# Altium schematic sheet [03] - 28PINS SCHEMATIC.SchDoc (part 1 of 3)
size 558 x 419 mm; DocumentNumber: 3; SheetNumber: 4; SheetTotal: 5
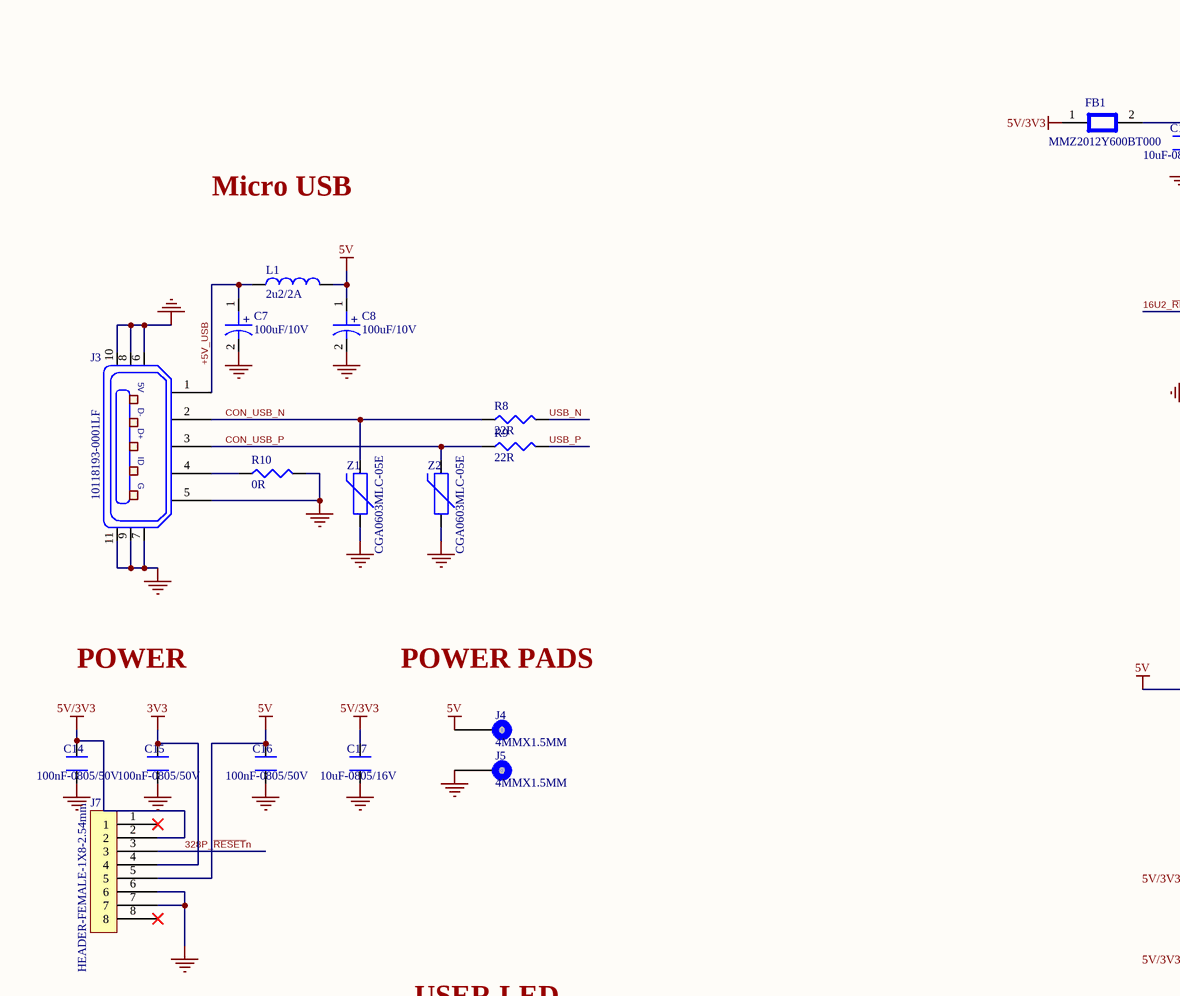
[diagram p0: [03] - 28PINS SCHEMATIC.SchDoc, top left]
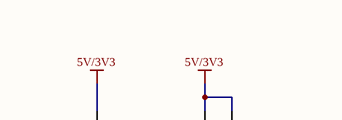
[diagram p1: [03] - 28PINS SCHEMATIC.SchDoc, top right]
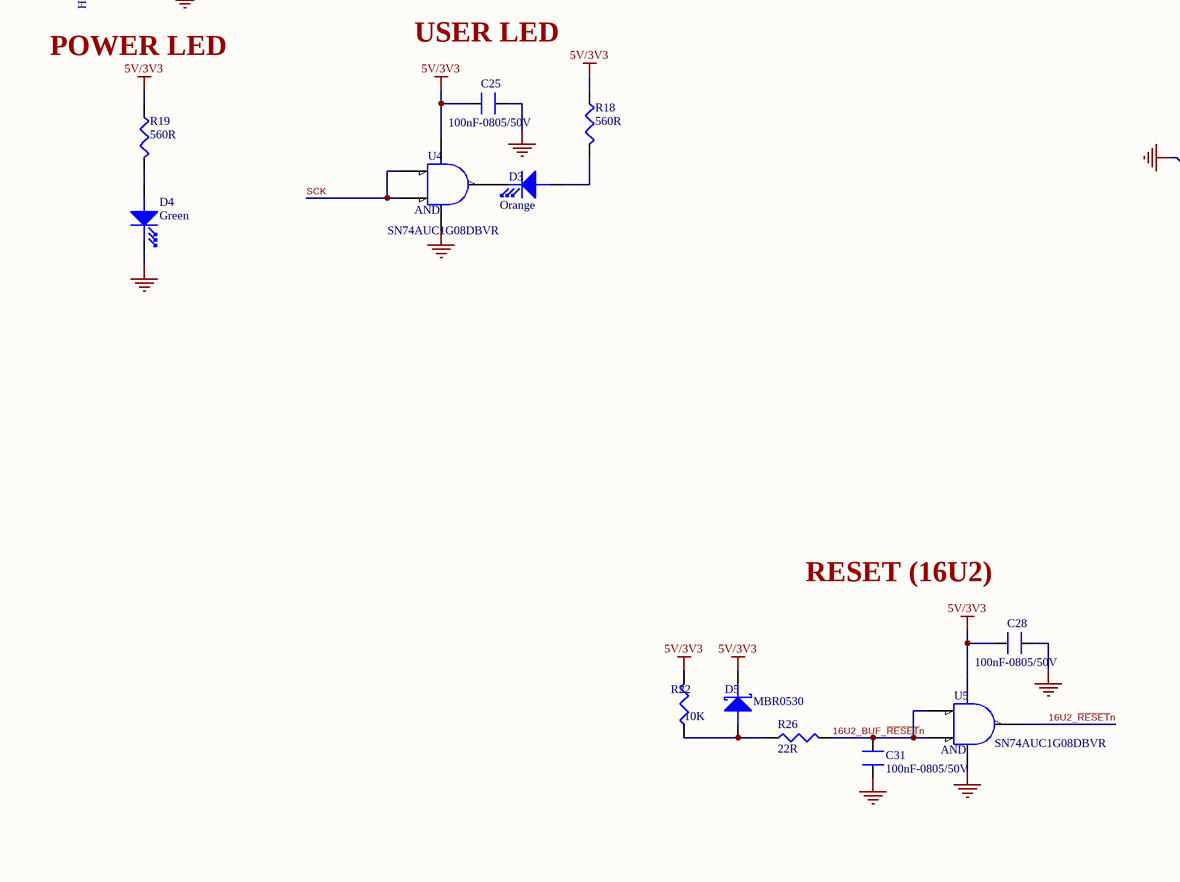
[diagram p2: [03] - 28PINS SCHEMATIC.SchDoc, bottom left]
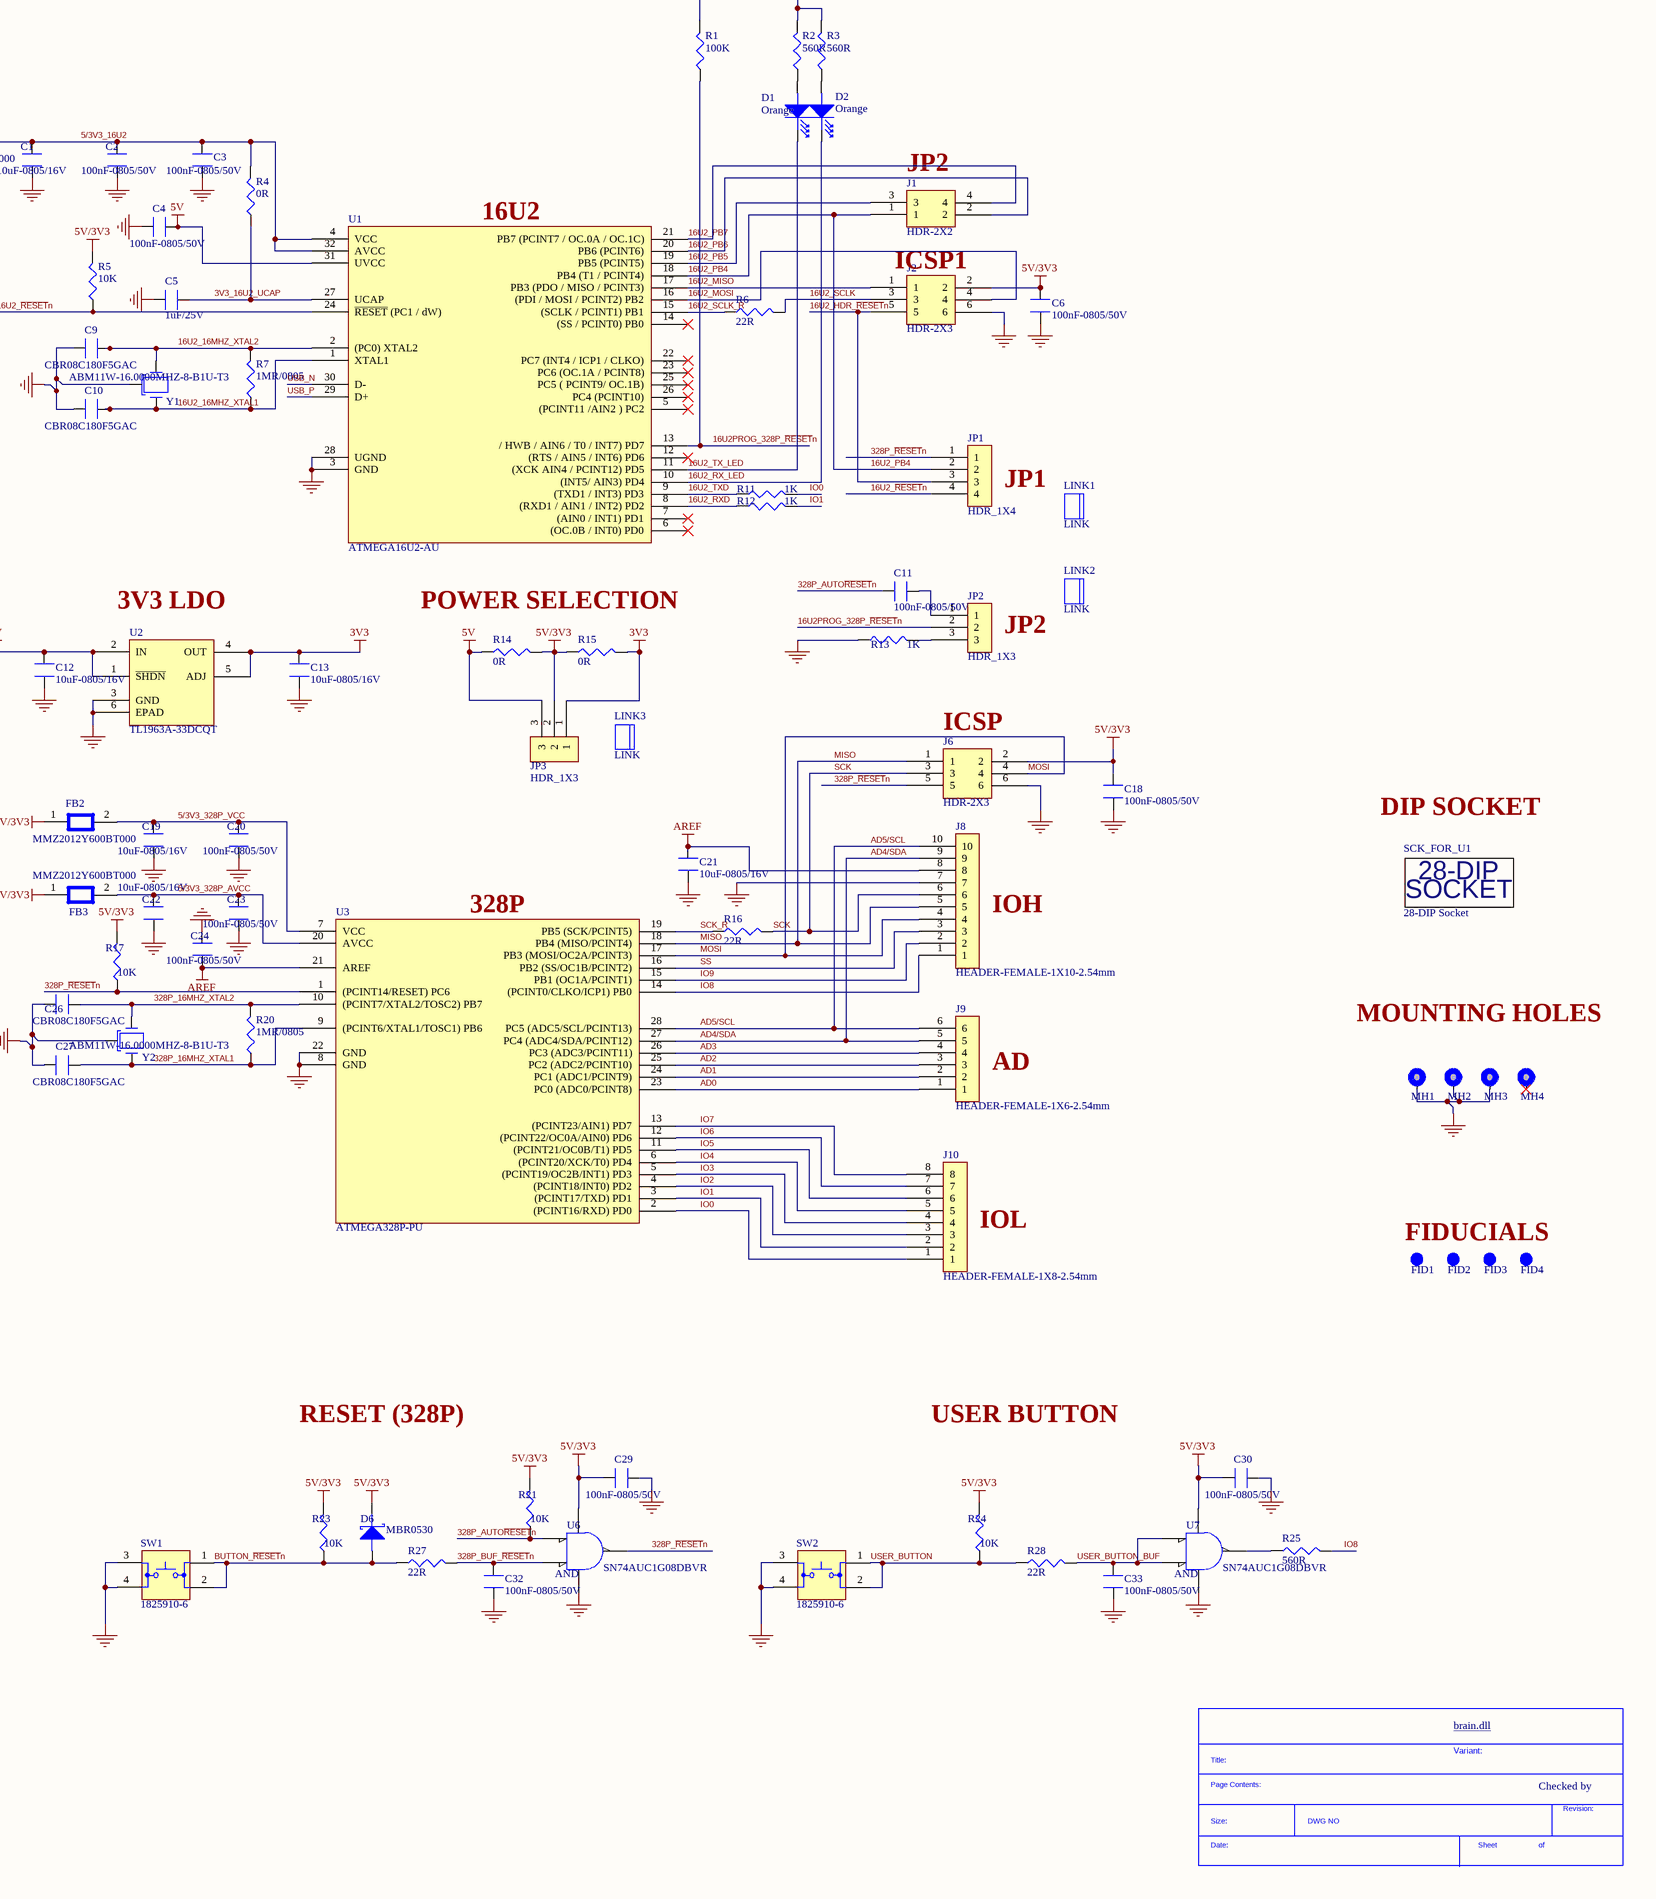
[diagram p3: [03] - 28PINS SCHEMATIC.SchDoc, bottom right]

## Parts
*?  SDTitleBlock  (value not drawn)  (graphical)
C1  10uF-0805/16V  [C0805]
C2  100nF-0805/50V  [C0805]
C3  100nF-0805/50V  [C0805]
C4  100nF-0805/50V  [C0805]
C5  1uF/25V  [C0805]
C6  100nF-0805/50V  [C0805]
C7  100uF/10V  [C_ALU_E_SIZE]
C8  100uF/10V  [C_ALU_E_SIZE]
C9  CBR08C180F5GAC  [C0805]
C10  CBR08C180F5GAC  [C0805]
C11  100nF-0805/50V  [C0805]
C12  10uF-0805/16V  [C0805]
C13  10uF-0805/16V  [C0805]
C14  100nF-0805/50V  [C0805]
C15  100nF-0805/50V  [C0805]
C16  100nF-0805/50V  [C0805]
C17  10uF-0805/16V  [C0805]
C18  100nF-0805/50V  [C0805]
C19  10uF-0805/16V  [C0805]
C20  100nF-0805/50V  [C0805]
C21  10uF-0805/16V  [C0805]
C22  10uF-0805/16V  [C0805]
C23  100nF-0805/50V  [C0805]
C24  100nF-0805/50V  [C0805]
C25  100nF-0805/50V  [C0805]
C26  CBR08C180F5GAC  [C0805]
C27  CBR08C180F5GAC  [C0805]
C28  100nF-0805/50V  [C0805]
C29  100nF-0805/50V  [C0805]
C30  100nF-0805/50V  [C0805]
C31  100nF-0805/50V  [C0805]
C32  100nF-0805/50V  [C0805]
C33  100nF-0805/50V  [C0805]
D1  Orange  [LED-0603]
D2  Orange  [LED-0603]
D3  Orange  [LED-0603]
D4  Green  [LED-0603]
D5  MBR0530  [SOD-123]
D6  MBR0530  [SOD-123]
FB1  MMZ2012Y600BT000  [C0805]
FB2  MMZ2012Y600BT000  [C0805]
FB3  MMZ2012Y600BT000  [C0805]
FID1  FID_1MMC  [FID_40X120D]  (value not drawn)  (no BOM)
FID2  FID_1MMC  [FID_40X120D]  (value not drawn)  (no BOM)
FID3  FID_1MMC  [FID_40X120D]  (value not drawn)  (no BOM)
FID4  FID_1MMC  [FID_40X120D]  (value not drawn)  (no BOM)
J1  HDR-2X2  [HDR-2X2-2.54MM]
J2  HDR-2X3  [HDR-2X3-2.54MM]
J3  10118193-0001LF  [USB-A]
J4  4MMX1.5MM  [PAD_WITH_HOLE_4MMX1.5MM]  (no BOM)
J5  4MMX1.5MM  [PAD_WITH_HOLE_4MMX1.5MM]  (no BOM)
J6  HDR-2X3  [HDR-2X3-2.54MM]
J7  HEADER-FEMALE-1X8-2.54mm  [FEMALE-1X8-2.54mm]
J8  HEADER-FEMALE-1X10-2.54mm  [FEMALE-1X10-2.54mm]
J9  HEADER-FEMALE-1X6-2.54mm  [FEMALE-1X6-2.54mm]
J10  HEADER-FEMALE-1X8-2.54mm  [FEMALE-1X8-2.54mm]
JP1  HDR_1X4  [HDR-1X4-2.54mm]
JP2  HDR_1X3  [FEMALE-1X3-2.54mm]
JP3  HDR_1X3  [FEMALE-1X3-2.54mm]
L1  2u2/2A  [C1210_IND]
LINK1  LINK  (mechanical)
LINK2  LINK  (mechanical)
LINK3  LINK  (mechanical)
MH1  MH_7.4MMC_3.2MMD  [MH_7.4MMC_3.2MMD]  (value not drawn)  (no BOM)
MH2  MH_7.4MMC_3.2MMD  [MH_7.4MMC_3.2MMD]  (value not drawn)  (no BOM)
MH3  MH_7.4MMC_3.2MMD  [MH_7.4MMC_3.2MMD]  (value not drawn)  (no BOM)
MH4  MH_7.4MMC_3.2MMD  [MH_7.4MMC_3.2MMD_NON_COPPER_NPLT]  (value not drawn)  (no BOM)
R1  100K  [R0805]
R2  560R  [R0805]
R3  560R  [R0805]
R4  0R  [R0805]
R5  10K  [R0805]
R6  22R  [R0805]
R7  1MR/0805  [R0805]
R8  22R  [R0805]
R9  22R  [R0805]
R10  0R  [R0805]
R11  1K  [R0805]
R12  1K  [R0805]
R13  1K  [R0805]
R14  0R  [R0805]
R15  0R  [R0805]
R16  22R  [R0805]
R17  10K  [R0805]
R18  560R  [R0805]
R19  560R  [R0805]
R20  1MR/0805  [R0805]
R21  10K  [R0805]
R22  10K  [R0805]
R23  10K  [R0805]
R24  10K  [R0805]
R25  560R  [R0805]
R26  22R  [R0805]
R27  22R  [R0805]
R28  22R  [R0805]
SCK_FOR_U1  28-DIP Socket  [28_DIP_7.62mm_SOCKET]
SW1  1825910-6  [1825910-6]
SW2  1825910-6  [1825910-6]
U1  ATMEGA16U2-AU  [TQFP32]
U2  TL1963A-33DCQT  [DCQ (R-PDSO-G6)]
U3  ATMEGA328P-PU  [DIP28]
U4  SN74AUC1G08DBVR  [DBV-SOT-23-5]
U5  SN74AUC1G08DBVR  [DBV-SOT-23-5]
U6  SN74AUC1G08DBVR  [DBV-SOT-23-5]
U7  SN74AUC1G08DBVR  [DBV-SOT-23-5]
Y1  ABM11W-16.0000MHZ-8-B1U-T3  [ABM11W]
Y2  ABM11W-16.0000MHZ-8-B1U-T3  [ABM11W]
Z1  CGA0603MLC-05E  [Z0603]
Z2  CGA0603MLC-05E  [Z0603]

## Nets
3V3: C13.2 C15.2 J7.4 JP3.1 R15.2 U2.4(OUT) U2.5(ADJ)
5V: C4.2 C8.1 C12.2 C16.2 J4.1 J7.5 JP3.3 L1.2 R14.1 U1.31(UVCC) U2.1(~{SHDN}) U2.2(IN)
5V/3V3: C6.2 C14.2 C17.2 C18.2 C25.2 C28.2 C29.2 C30.2 D5.1(Cathode) D6.1(Cathode) FB1.1 FB2.1 FB3.1 J2.2 J6.2 J7.2 JP3.2 R1.2 R2.2 R3.2 R5.2 R14.2 R15.1 R17.2 R18.1 R19.1 R21.2 R22.2 R23.2 R24.2 U4.5 U5.5 U6.5 U7.5
AREF: C21.2 C24.2 J8.8 U3.21(AREF)
GND: C1.1 C2.1 C3.1 C4.1 C5.1 C6.1 C7.2 C8.2 C9.1 C10.1 C12.1 C13.1 C14.1 C15.1 C16.1 C17.1 C18.1 C19.1 C20.1 C21.1 C22.1 C23.1 C24.1 C25.1 C26.1 C27.1 C28.1 C29.1 C30.1 C31.2 C32.2 C33.2 D4.1(Cathode) J2.6 J3.5 J3.6 J3.7 J3.8 J3.9 J3.10 J3.11 J5.1 J6.6 J7.6 J7.7 J8.7 MH1.1 MH2.1 MH3.1 R10.2 R13.1 SW1.3 SW1.4 SW2.3 SW2.4 U1.3(GND) U1.28(UGND) U2.3(GND) U2.6(EPAD) U3.8(GND) U3.22(GND) U4.3 U5.3 U6.3 U7.3 Y1.2 Y2.2 Z1.1 Z2.1
3V3_16U2_UCAP: C5.2 R4.1 U1.27(UCAP)
5/3V3_16U2: C1.2 C2.2 C3.2 FB1.2 R4.2 U1.4(VCC) U1.32(AVCC)
5/3V3_328P_AVCC: C22.2 C23.2 FB3.2 U3.20(AVCC)
5/3V3_328P_VCC: C19.2 C20.2 FB2.2 U3.7(VCC)
16U2_16MHZ_XTAL1: C10.2 R7.1 U1.1(XTAL1) Y1.3
16U2_16MHZ_XTAL2: C9.2 R7.2 U1.2((PC0)_XTAL2) Y1.1
16U2_BUF_~{RESET}n: C31.1 R26.2 U5.1 U5.2
16U2_HDR_~{RESET}n: J2.5 JP1.3
16U2_MISO: J2.1 U1.17(PB3_(PDO_/_MISO_/_PCINT3))
16U2_MOSI: J2.4 U1.16((PDI_/_MOSI_/_PCINT2)_PB2)
16U2_PB4: J1.1 JP1.2 U1.18(PB4_(T1_/_PCINT4))
16U2_PB5: J1.3 U1.19(PB5_(PCINT5))
16U2_PB6: J1.2 U1.20(PB6_(PCINT6))
16U2_PB7: J1.4 U1.21(PB7_(PCINT7_/_OC.0A_/_OC.1C))
16U2_~{RESET}n: JP1.4 R5.1 U1.24(~{RESET}_(PC1_/_dW)) U5.4
16U2_RX_LED: D2.1(Cathode) U1.10((INT5/_AIN3)_PD4)
16U2_RXD: R12.1 U1.8((RXD1_/_AIN1_/_INT2)_PD2)
16U2_SCLK: J2.3 R6.2
16U2_SCLK_R: R6.1 U1.15((SCLK_/_PCINT1)_PB1)
16U2_TX_LED: D1.1(Cathode) U1.11((XCK_AIN4_/_PCINT12)_PD5)
16U2_TXD: R11.1 U1.9((TXD1_/_INT3)_PD3)
16U2PROG_328P_~{RESET}n: JP2.2 R1.1 U1.13(/_HWB_/_AIN6_/_T0_/_INT7)_PD7)
328P_16MHZ_XTAL1: C27.2 R20.1 U3.9((PCINT6/XTAL1/TOSC1)_PB6) Y2.3
328P_16MHZ_XTAL2: C26.2 R20.2 U3.10((PCINT7/XTAL2/TOSC2)_PB7) Y2.1
328P_AUTO~{RESET}n: C11.2 R21.1 U6.1
328P_BUF_~{RESET}n: C32.1 R27.2 U6.2
328P_~{RESET}n: J6.5 J7.3 JP1.1 R17.1 U3.1((PCINT14/RESET)_PC6) U6.4
+5V_USB: C7.1 J3.1 L1.1
AD0: J9.1 U3.23(PC0_(ADC0/PCINT8))
AD1: J9.2 U3.24(PC1_(ADC1/PCINT9))
AD2: J9.3 U3.25(PC2_(ADC2/PCINT10))
AD3: J9.4 U3.26(PC3_(ADC3/PCINT11))
AD4/SDA: J8.9 J9.5 U3.27(PC4_(ADC4/SDA/PCINT12))
AD5/SCL: J8.10 J9.6 U3.28(PC5_(ADC5/SCL/PCINT13))
BUTTON_~{RESET}n: D6.2(Anode) R23.1 R27.1 SW1.1 SW1.2
CON_USB_N: J3.2 R8.1 Z1.2
CON_USB_P: J3.3 R9.1 Z2.2
IO0: J10.1 R11.2 U3.2((PCINT16/RXD)_PD0)
IO1: J10.2 R12.2 U3.3((PCINT17/TXD)_PD1)
IO2: J10.3 U3.4((PCINT18/INT0)_PD2)
IO3: J10.4 U3.5((PCINT19/OC2B/INT1)_PD3)
IO4: J10.5 U3.6((PCINT20/XCK/T0)_PD4)
IO5: J10.6 U3.11((PCINT21/OC0B/T1)_PD5)
IO6: J10.7 U3.12((PCINT22/OC0A/AIN0)_PD6)
IO7: J10.8 U3.13((PCINT23/AIN1)_PD7)
IO8: J8.1 R25.2 U3.14((PCINT0/CLKO/ICP1)_PB0)
IO9: J8.2 U3.15(PB1_(OC1A/PCINT1))
MISO: J6.1 J8.5 U3.18(PB4_(MISO/PCINT4))
MOSI: J6.4 J8.4 U3.17(PB3_(MOSI/OC2A/PCINT3))
SCK: J6.3 J8.6 R16.2 U4.1 U4.2
SCK_R: R16.1 U3.19(PB5_(SCK/PCINT5))
SS: J8.3 U3.16(PB2_(SS/OC1B/PCINT2))
USB_N: R8.2 U1.30(D-)
USB_P: R9.2 U1.29(D+)
USER_BUTTON: R24.1 R28.1 SW2.1 SW2.2
USER_BUTTON_BUF: C33.1 R28.2 U7.1 U7.2
NetC11_1: C11.1 JP2.1
NetD1_2: D1.2(Anode) R2.1
NetD2_2: D2.2(Anode) R3.1
NetD3_1: D3.1(Cathode) U4.4
NetD3_2: D3.2(Anode) R18.2
NetD4_2: D4.2(Anode) R19.2
NetD5_2: D5.2(Anode) R22.1 R26.1
NetJ3_4: J3.4 R10.1
NetJP2_3: JP2.3 R13.2
NetR25_1: R25.1 U7.4

Not connected (* = marked no-connect by the designer): J7 1* 8*; MH4 1*; U1 5((PCINT11_/AIN2_)_PC2)* 6((OC.0B_/_INT0)_PD0)* 7((AIN0_/_INT1)_PD1)* 12((RTS_/_AIN5_/_INT6)_PD6)* 14((SS_/_PCINT0)_PB0)* 22(PC7_(INT4_/_ICP1_/_CLKO))* 23(PC6_(OC.1A_/_PCINT8))* 25(PC5_(_PCINT9/_OC.1B))* 26(PC4_(PCINT10))*

## Notes on the sheet
- Micro USB
- (near J1) JP2
- (near U1) 16U2
- (near J2) ICSP1
- JP1
- POWER
- POWER PADS
- (near U2) 3V3 LDO
- POWER SELECTION
- JP2
- (near J6) ICSP
- DIP SOCKET
- USER LED
- (near U3) 328P
- (near J8) IOH
- POWER LED
- MOUNTING HOLES
- (near J9) AD
- (near J10) IOL
- FIDUCIALS
- RESET (16U2)
- RESET (328P)
- USER BUTTON
- brain.dll
- Variant:
- Checked by
- (in symbol 4828-3004-CP) 28-DIP; SOCKET
- (in symbol 10118193-0001LF) 5V; D-; D+; ID; G
- (in symbol EEE-HA1A101AP) +
- (in symbol SDTitleBlock) Title:; Page Contents:; Revision:; Size:; DWG NO; Date:; Sheet; of
- (in symbol SN74AUC1G08DBVR) AND